# EAGLE schematic masterslavejk (EAGLE 7.2.0)
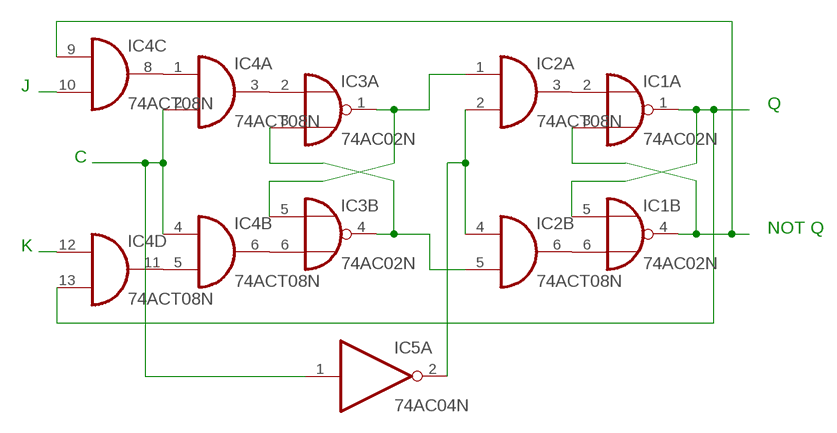
[diagram p0: schematic, sheet 1]

## Parts
IC1  74AC02N  [DIL14]
IC2  74ACT08N  [DIL14]
IC3  74AC02N  [DIL14]
IC4  74ACT08N  [DIL14]
IC5  74AC04N  [DIL14]

## Nets
N$1: IC1.2(A:I0) IC2.3(A:O)
N$2: IC1.6(B:I1) IC2.6(B:O)
N$3: IC2.2(A:I1) IC2.4(B:I0) IC5.2(A:O)
N$5: IC1.1(A:O) IC1.5(B:I0) IC4.13(D:I1)
N$6: IC1.3(A:I1) IC1.4(B:O) IC4.9(C:I0)
N$8: IC3.2(A:I0) IC4.3(A:O)
N$9: IC3.6(B:I1) IC4.6(B:O)
N$10: IC2.1(A:I0) IC3.1(A:O) IC3.5(B:I0)
N$11: IC2.5(B:I1) IC3.3(A:I1) IC3.4(B:O)
N$12: IC4.2(A:I1) IC4.4(B:I0) IC5.1(A:I)
N$13: IC4.1(A:I0) IC4.8(C:O)
N$14: IC4.5(B:I1) IC4.11(D:O)
N$17: IC4.12(D:I0)
N$18: IC4.10(C:I1)
Unconnected: IC1.8(C:I0) IC1.9(C:I1) IC1.10(C:O) IC1.11(D:I0) IC1.12(D:I1) IC1.13(D:O) IC2.8(C:O) IC2.9(C:I0) IC2.10(C:I1) IC2.11(D:O) IC2.12(D:I0) IC2.13(D:I1) IC3.8(C:I0) IC3.9(C:I1) IC3.10(C:O) IC3.11(D:I0) IC3.12(D:I1) IC3.13(D:O) IC5.3(B:I) IC5.4(B:O) IC5.5(C:I) IC5.6(C:O) IC5.8(D:O) IC5.9(D:I) IC5.10(E:O) IC5.11(E:I) IC5.12(F:O) IC5.13(F:I)

## Notes on the sheet
- J
- Q
- C
- NOT Q
- K

## Power pins joined to a net without a drawn wire
GND: IC1.7(P:GND) IC2.7(P:GND) IC3.7(P:GND) IC4.7(P:GND) IC5.7(P:GND)
VCC: IC1.14(P:VCC) IC2.14(P:VCC) IC3.14(P:VCC) IC4.14(P:VCC) IC5.14(P:VCC)

## Library data of the parts
IC1 IC3 = 74xx-eu:74*02: Quad 2-input NOR gate
IC2 IC4 = 74xx-eu:74*08: Quad 2-input AND gate
IC5 = 74xx-eu:74*04: Hex INVERTER